# EAGLE design ig-normal-ver12 (EAGLE 9.6.2)
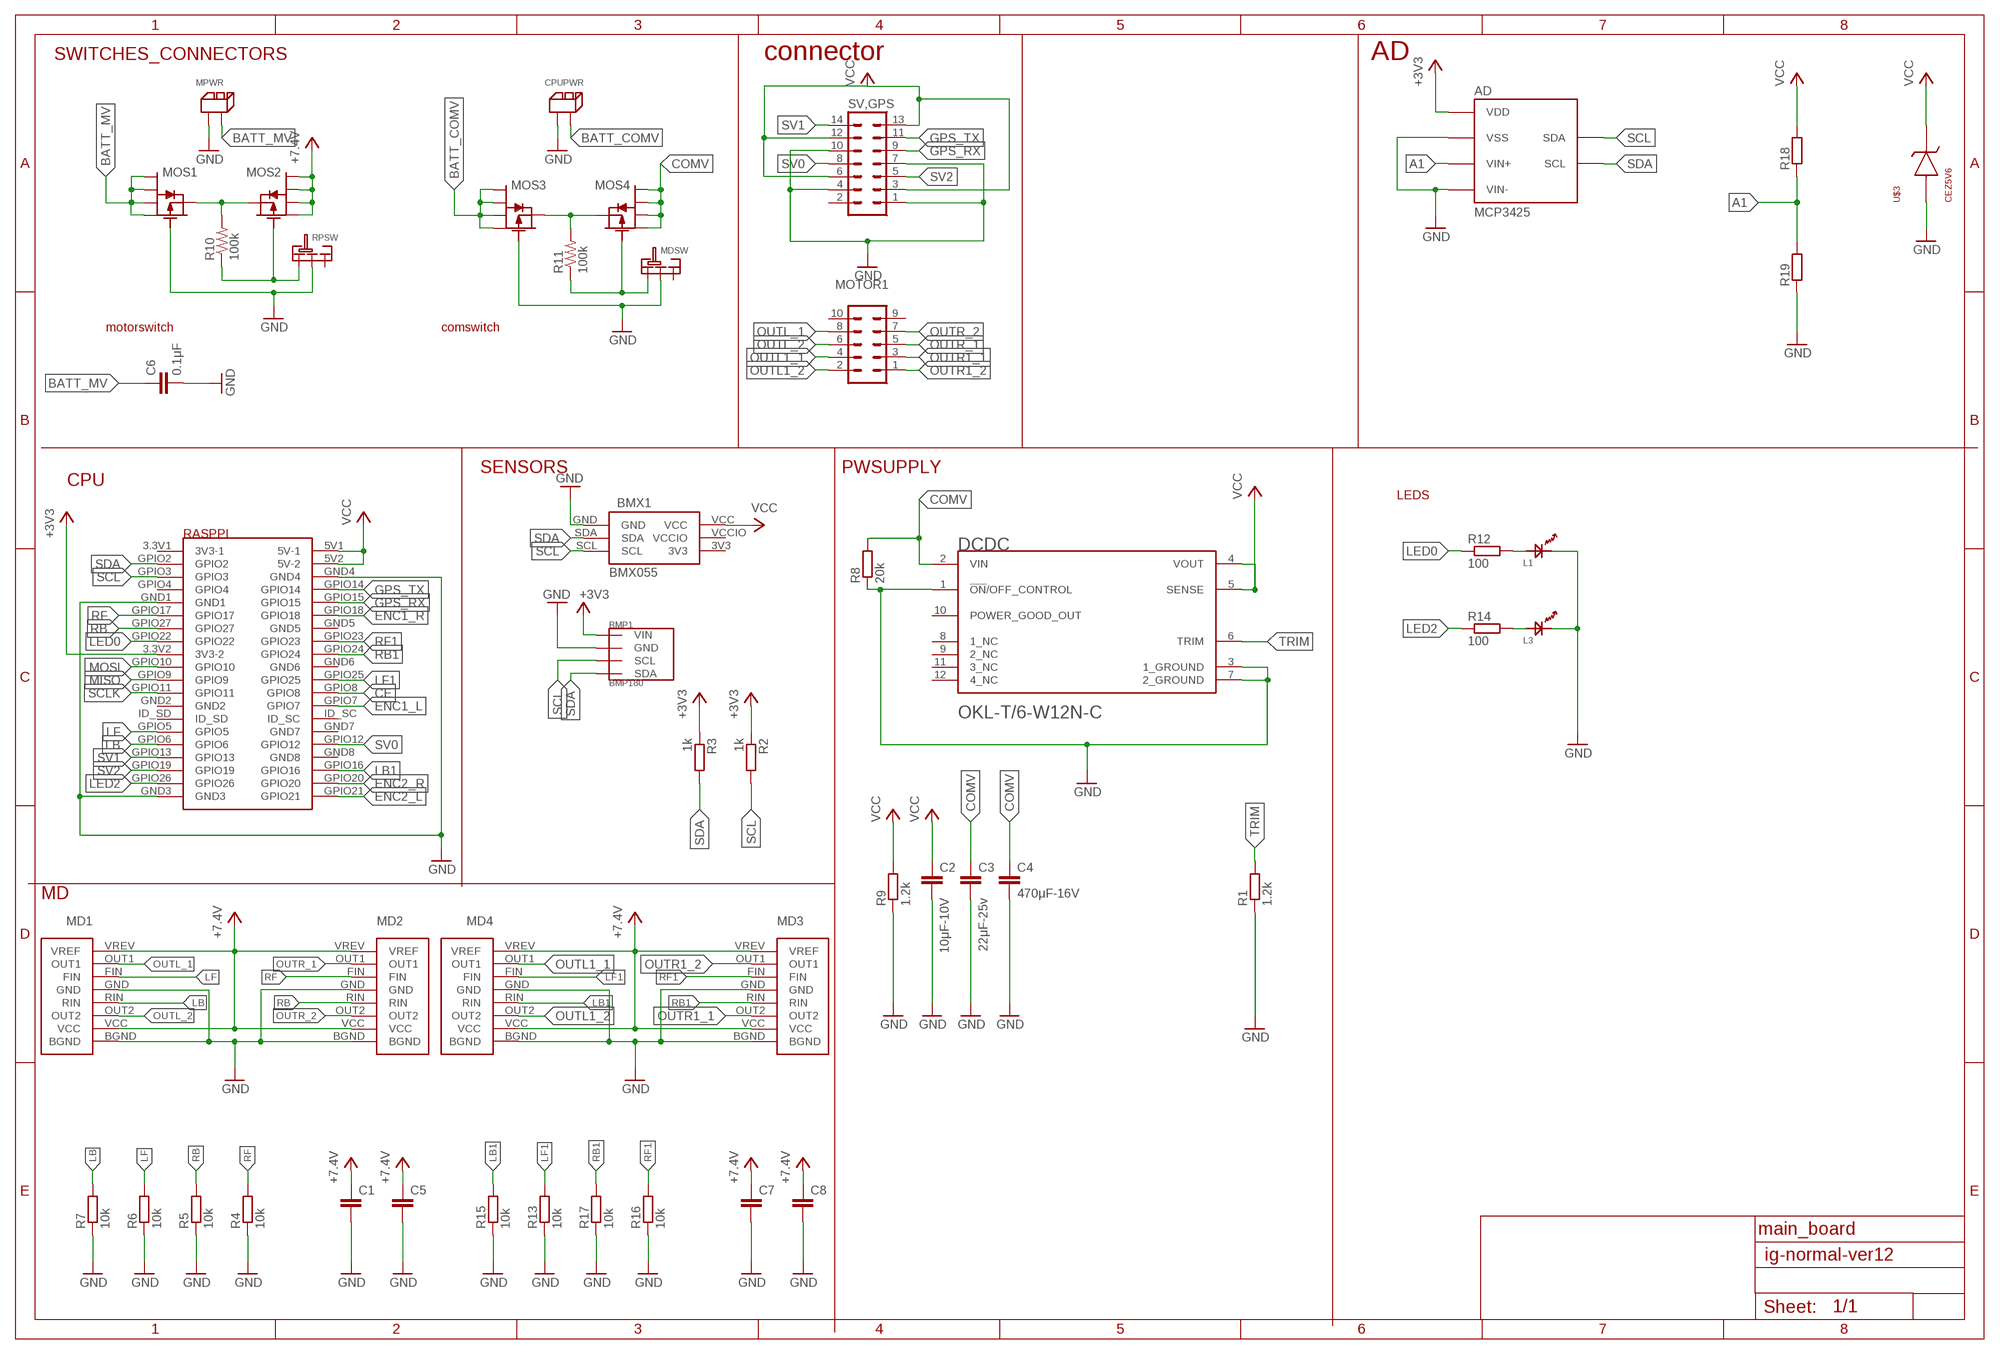
[diagram p0: schematic, sheet 1]

## Parts
AD  MCP3425  [SOT23-6]
BMP1  BMP180  [GY-68]
BMX1  BMX055  [BMX055]
C1  C-EUC0603  [C0603]
C2  10μF-10V  C-EUC0603  [C0603]
C3  22μF-25v  C-EUC0805  [C0805]
C4  470μF-16V  C-EUC0603  [C0603]
C5  C-EUC0603  [C0603]
C6  0.1μF  C-EUC0603  [C0603]
C7  C-EUC0603  [C0603]
C8  C-EUC0603  [C0603]
CPUPWR  2PIN  [2PIN]
DCDC  OKL-T/6-W12N-CMURATA_OKL-T-6-W12N-C_0_0  [MURATA_OKL-T-6-W12N-C_0]
L1  OSXX1608C1A  [OSXX1608C1A]
L3  OSXX1608C1A  [OSXX1608C1A]
MD1  BD6222HFP-TR  [BD6222HFP-TR]
MD2  BD6222HFP-TR  [BD6222HFP-TR]
MD3  BD6222HFP-TR  [BD6222HFP-TR]
MD4  BD6222HFP-TR  [BD6222HFP-TR]
MDSW  SRIDE_SWITCH  [SRIDE_SWITCH]
MOS1  PCH_SSM6J808R  [SSM6J808R]
MOS2  PCH_SSM6J808R  [SSM6J808R]
MOS3  PCH_SSM6J808R  [SSM6J808R]
MOS4  PCH_SSM6J808R  [SSM6J808R]
MOTOR1  ML10L  [ML10L]
MPWR  2PIN  [2PIN]
R1  1.2k  R-EU_R0805  [R0805]
R2  1k  R-EU_R0603  [R0603]
R3  1k  R-EU_R0603  [R0603]
R4  10k  R-EU_R0603  [R0603]
R5  10k  R-EU_R0603  [R0603]
R6  10k  R-EU_R0603  [R0603]
R7  10k  R-EU_R0603  [R0603]
R8  20k  R-EU_R0603  [R0603]
R9  1.2k  R-EU_R0805  [R0805]
R10  100k  R-US_R0603  [R0603]
R11  100k  R-US_R0603  [R0603]
R12  100  R-EU_R0603  [R0603]
R13  10k  R-EU_R0603  [R0603]
R14  100  R-EU_R0603  [R0603]
R15  10k  R-EU_R0603  [R0603]
R16  10k  R-EU_R0603  [R0603]
R17  10k  R-EU_R0603  [R0603]
R18  R-EU_R0603  [R0603]
R19  R-EU_R0603  [R0603]
RASPPI  RASPBERYPIZEROW  [RASPBERYPIZEROW]
RPSW  SRIDE_SWITCH  [SRIDE_SWITCH]
SV,GPS  ML14L  [ML14L]
U$3  CEZ5V6  [CEZ5V6]

## Nets
+3V3 [PWR]: AD.5(VDD) BMP1.P1(VIN) R2.1 R3.1 RASPPI.3.3V2(3V3-2)
+5V [PWR]: C1.1 C5.1 C7.1 C8.1 MD1.VCC MD1.VREV(VREF) MD2.VCC MD2.VREV(VREF) MD3.VCC MD3.VREV(VREF) MD4.VCC MD4.VREV(VREF) MOS2.1 MOS2.2 MOS2.5 MOS2.6 ; supply symbol labelled +7.4V
A1: AD.1(VIN+) R18.1 R19.2
BATT_COMV [PWR]: CPUPWR.P$2 MOS3.1 MOS3.2 MOS3.5 MOS3.6
BATT_MV [PWR]: C6.1 MOS1.1 MOS1.2 MOS1.5 MOS1.6 MPWR.P$2
CE: RASPPI.GPIO8
COMV [PWR]: C3.1 C4.1 DCDC.2(VIN) MOS4.1 MOS4.2 MOS4.5 MOS4.6 R8.2
ENC1_L: RASPPI.GPIO7
ENC1_R: RASPPI.GPIO18
ENC2_L: RASPPI.GPIO21
ENC2_R: RASPPI.GPIO20
GND [mospwr]: AD.2(VSS) AD.6(VIN-) BMP1.P2(GND) BMX1.GND C1.2 C2.2 C3.2 C4.2 C5.2 C6.2 C7.2 C8.2 CPUPWR.P$1 DCDC.1(!ON!/OFF_CONTROL) DCDC.3(1_GROUND) DCDC.7(2_GROUND) L1.CT L3.CT MD1.BGND MD1.GND MD2.BGND MD2.GND MD3.BGND MD3.GND MD4.BGND MD4.GND MDSW.LR MOS1.3 MOS3.3 MPWR.P$1 R1.1 R4.1 R5.1 R6.1 R7.1 R8.1 R9.1 R13.1 R15.1 R16.1 R17.1 R19.1 RASPPI.GND1 RASPPI.GND3 RASPPI.GND4 RPSW.LR SV,GPS.1 SV,GPS.4 SV,GPS.7 SV,GPS.10 U$3.P$1
GPS_RX: RASPPI.GPIO15 SV,GPS.9
GPS_TX: RASPPI.GPIO14 SV,GPS.11
LB: MD1.RIN R7.2 RASPPI.GPIO6
LB1: MD4.RIN R15.2 RASPPI.GPIO16
LED0: R12.1 RASPPI.GPIO22
LED2: R14.1 RASPPI.GPIO26
LF: MD1.FIN R6.2 RASPPI.GPIO5
LF1: MD4.FIN R13.2 RASPPI.GPIO25
MISO: RASPPI.GPIO9
MOSI: RASPPI.GPIO10
N$1 [mospwr]: MOS3.4 MOS4.4 R11.2
N$2 [mospwr]: MDSW.L MOS4.3 R11.1
N$3: L1.AN R12.2
N$5: L3.AN R14.2
N$6 [mospwr]: MOS1.4 MOS2.4 R10.2
N$7 [mospwr]: MOS2.3 R10.1 RPSW.L
OUTL1_1: MD4.OUT1 MOTOR1.4
OUTL1_2: MD4.OUT2 MOTOR1.2
OUTL_1: MD1.OUT1 MOTOR1.8
OUTL_2: MD1.OUT2 MOTOR1.6
OUTR1_1: MD3.OUT2 MOTOR1.3
OUTR1_2: MD3.OUT1 MOTOR1.1
OUTR_1: MD2.OUT1 MOTOR1.5
OUTR_2: MD2.OUT2 MOTOR1.7
RB: MD2.RIN R5.2 RASPPI.GPIO27
RB1: MD3.RIN R17.2 RASPPI.GPIO24
RF: MD2.FIN R4.2 RASPPI.GPIO17
RF1: MD3.FIN R16.2 RASPPI.GPIO23
SCL: AD.4(SDA) BMP1.P3(SCL) BMX1.SCL R2.2 RASPPI.GPIO3
SCLK: RASPPI.GPIO11
SDA: AD.3(SCL) BMP1.P4(SDA) BMX1.SDA R3.2 RASPPI.GPIO2
SV0: RASPPI.GPIO12 SV,GPS.8
SV1: RASPPI.GPIO13 SV,GPS.14
SV2: RASPPI.GPIO19 SV,GPS.5
TRIM: DCDC.6(TRIM) R1.2
VCC [PWR]: BMX1.VCC C2.1 DCDC.4(VOUT) DCDC.5(SENSE) R9.2 R18.2 RASPPI.5V1(5V-1) RASPPI.5V2(5V-2) SV,GPS.3 SV,GPS.6 SV,GPS.12 SV,GPS.13 U$3.P$2
Unconnected: DCDC.8(1_NC) DCDC.9(2_NC) DCDC.10(POWER_GOOD_OUT) DCDC.11(3_NC) DCDC.12(4_NC) MDSW.R MOTOR1.9 MOTOR1.10 RASPPI.3.3V1(3V3-1) RASPPI.GND2 RASPPI.GND5 RASPPI.GND6 RASPPI.GND7 RASPPI.GND8 RASPPI.GPIO4 RASPPI.ID_SC RASPPI.ID_SD RPSW.R SV,GPS.2

## Notes on the sheet
- SWITCHES_CONNECTORS | connector | AD
- motorswitch | comswitch
- SENSORS | PWSUPPLY
- CPU
- LEDS
- MD
- main_board

## Power pins joined to a net without a drawn wire
3V3: BMX1.3V3
VCCIO: BMX1.VCCIO

## Library data of the parts
AD = bt:MCP3425: Microchip MCP3425 ADC The MCP3425 is a single channel low-noise, high accuracy ?? A/D converter with differential inputs and up to 16 bits of resolution in a small SOT-23-6 package. The on-board precision 2.048V reference voltage enables an input range of ±2.048V differentially (? voltage = 4.096V). The device uses a two-wire I2C compatible serial interface and operates from a single 2.7V to 5.5V power supply. The MCP3425 device performs conversion at rates of 15, 60, or 240 samples per second (SPS) depending on the user controllable configuration bit settings using the two-wire I2C serial interface Reference: http://ww1.microchip.com/downloads/en/DeviceDoc/22072a.pdf
BMP1 = BMP180:BMP180
BMX1 = BMX055:BMX055
C1-C8 = rcl:C-EU: CAPACITOR, European symbol; SPICEPREFIX: C
CPUPWR MPWR = XR Connector:2PIN
DCDC = OKL-T_6-W12N-C:OKL-T/6-W12N-C: Non-Isolated PoL Module DC DC Converter 1 Output 0.591 ~ 5.5V - - 6A 4.5V - 14V Input; AUTOMOTIVE: No; CENTROID_NOT_SPECIFIED: No; DATASHEET: https://www.murata.com/en-us/products/productdetail.aspx?partno=OKL-T/6-W12N-C; DEVICE_CLASS_L1: Integrated Circuits (ICs); DEVICE_CLASS_L2: Power Management ICs; DEVICE_CLASS_L3: Voltage Regulators - Switching; DIGIKEY_DESCRIPTION: DC DC CONVERTER 0.591-5.5V 30W; DIGIKEY_PART_NUMBER: 811-2214-1-ND; FOOTPRINT_VARIANT_NAME_0: Recommended_Land_Pattern; HEIGHT: 7.2mm; LEAD_FREE: Yes; MAX_SUPPLY_VOLTAGE: 14V; MF: Murata; MFG_PACKAGE_IDENT: OKL-T/6-W12; MFG_PACKAGE_IDENT_COMPONENT_ID: 4873da16363307f0; MFG_PACKAGE_IDENT_DATE: 0; MFG_PACKAGE_IDENT_REV: 0; MIN_SUPPLY_VOLTAGE: 4.5V; MOUSER_DESCRIPTION: Non-Isolated DC/DC Converters 12Vin .59-5.5Vout 6A 30W Neg Polarity; MOUSER_PART_NUMBER: 580-OKL-T/6-W12N-C; MPN: OKL-T/6-W12N-C; NOMINAL_SUPPLY_CURRENT: 20mA; NUMBER_OF_OUTPUTS: 1; OUTPUT_CURRENT: 6A; OUTPUT_TYPE: AdjustableProgrammable; OUTPUT_VOLTAGE: 0.591-5.5V; PACKAGE: iLGA12; PREFIX: MD; ROHS: Yes; SWITCHING_FREQUENCY: 600kHz; SWITCHING_TOPOLOGY: Buck; TEMPERATURE_RANGE_HIGH: +85°C; TEMPERATURE_RANGE_LOW: -40°C; VERIFICATION_VERSION: 0.0.0.3
L1 L3 = Chip LED:OSXX1608C1A
MD1-MD4 = BD6222HFP-TR:BD6222HFP-TR
MDSW RPSW = Sride Switch:SRIDE_SWITCH
MOS1-MOS4 = Chip MOSFET:PCH_SSM6J808R
MOTOR1 = con-ml:ML10L: HARTING; OC_FARNELL: unknown; OC_NEWARK: unknown
R1-R9 R12-R19 = rcl:R-EU_: RESISTOR, European symbol; SPICEPREFIX: R
R10 R11 = rcl:R-US_: RESISTOR, American symbol; SPICEPREFIX: R
RASPPI = RaspberyPiZeroW:RASPBERYPIZEROW
SV,GPS = con-ml:ML14L: HARTING; OC_FARNELL: unknown; OC_NEWARK: unknown
U$3 = CEZXVX:CEZ5V6

## Net classes
1 PWR: width 0.8 mm, clearance 0.1 mm
2 mospwr: width 0.45 mm

## Board
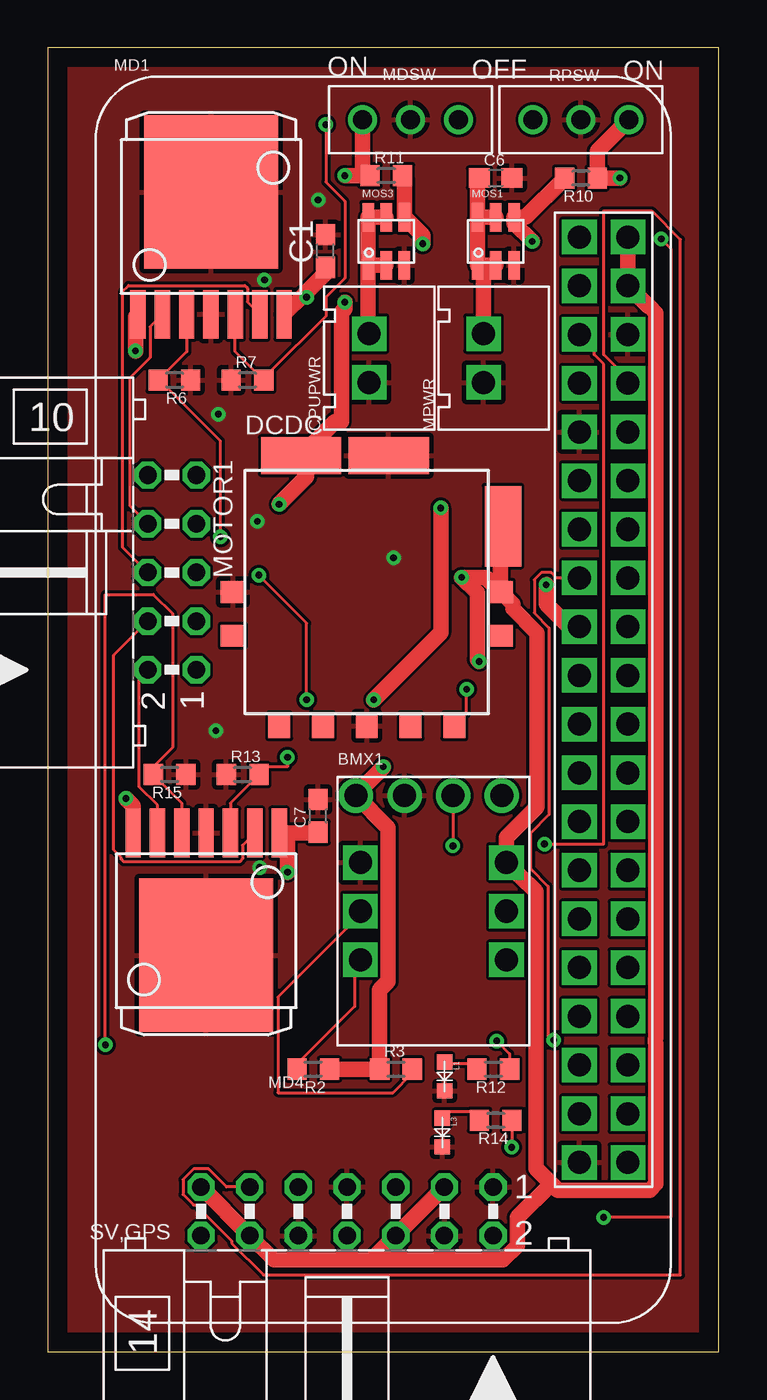
[diagram p1: board, top side]
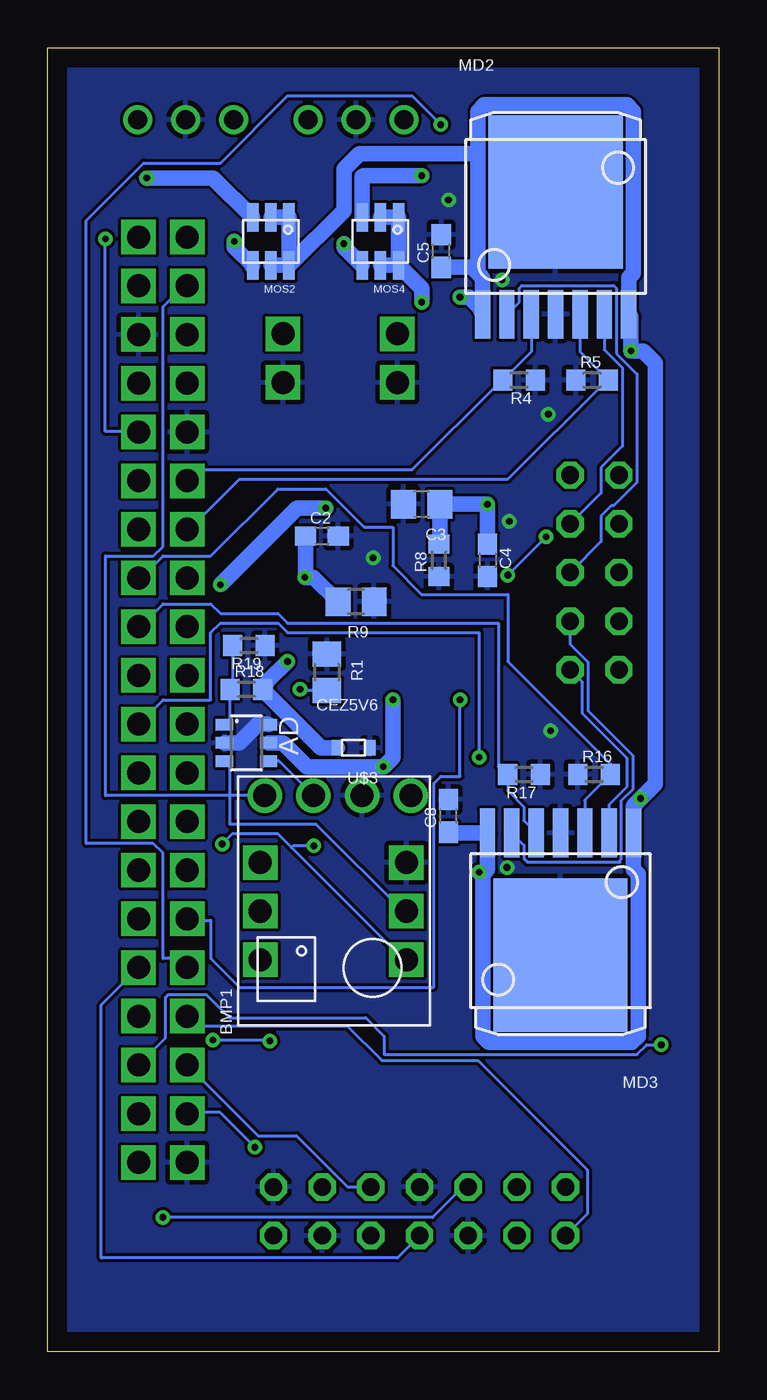
[diagram p2: board, bottom side, seen from below]

Size 35 x 68 mm. Coordinates in mm from the lower left corner, seen from the top.
Outline: 0,0 35,0 35,68 0,68 0,0
Copper layers (1*16): Top 0.035mm / dielectric 1.5mm / Bottom 0.035mm
Design rules "default": minimum track width 6mil, minimum drill 0.35mm, track to track 6mil, track to pad 6mil, pad to pad 6mil, via to via 6mil, smd to smd 6mil, copper to edge 40mil, drill to drill 6mil, minimum pad ring 10mil, minimum via ring 8mil, stop-mask expansion 4mil, vias tented up to drill 0mil, thermal gap 10mil

### Footprints (pad centres in the part's own frame; a part is rotated, then mirrored left to right if it is on the bottom)
SOT23-6 = smd 0.6 x 0.9: 1 -0.95,-1.15; 2 0,-1.15; 3 0.95,-1.15; 4 0.95,1.15; 5 0,1.15; 6 -0.95,1.15
GY-68 = drill 1.2: P1 -5,4; P2 -5,1.46; P3 -5,-1.08; P4 -5,-3.62
BMX055 = drill 1.2 pad 1.5 square: 3V3 8.81,-9.53; GND 1.19,-4.46; SCL 1.19,-9.53; SDA 1.19,-7; VCC 8.81,-4.46; VCCIO 8.81,-7
C0603 = smd 1.1 x 1: 1 -0.85,0; 2 0.85,0
C0805 = smd 1.3 x 1.5: 1 -0.95,0; 2 0.95,0
2PIN = drill 1.2 square: P$1 -1.27,0; P$2 1.27,0
MURATA_OKL-T-6-W12N-C_0 = smd 1.27 x 1.143: 1 -6.985,0; 5 6.985,0; 10 -6.985,-2.286; 11 6.985,-2.286 | smd 4.191 x 1.905: 2 -3.429,7.112; 3 1.143,7.112 | smd 1.905 x 4.191: 4 7.112,3.429 | smd 1.143 x 1.27: 6 4.572,-6.985; 7 0,-6.985; 8 -2.286,-6.985; 9 -4.572,-6.985; 12 2.286,-6.985
OSXX1608C1A = smd 0.8 x 0.8: AN -0.75,0; CT 0.75,0
BD6222HFP-TR = smd 7 x 8: BGND 0,6.378 | smd 0.8 x 2.54: FIN -1.27,0; GND 0,0; OUT1 -2.54,0; OUT2 2.54,0; RIN 1.27,0; VCC 3.81,0; VREV -3.81,0
SRIDE_SWITCH = drill 1: L -2.5,0; LR 0,0; R 2.5,0
SSM6J808R = smd 0.6 x 1.5: 1 -0.95,-1.25; 2 0,-1.25; 3 0.95,-1.25; 4 0.95,1.25; 5 0,1.25; 6 -0.95,1.25
ML10L = drill 0.914 octagon: 1 -5.08,-1.27; 2 -5.08,1.27; 3 -2.54,-1.27; 4 -2.54,1.27; 5 0,-1.27; 6 0,1.27; 7 2.54,-1.27; 8 2.54,1.27; 9 5.08,-1.27; 10 5.08,1.27
R0805 = smd 1.3 x 1.5: 1 -0.95,0; 2 0.95,0
R0603 = smd 1 x 1.1: 1 -0.85,0; 2 0.85,0
RASPBERYPIZEROW = drill 1.2 pad 1.676 square: 3.3V1 -1.27,24.13; 3.3V2 -1.27,3.81; 5V1 1.27,24.13; 5V2 1.27,21.59; GND1 -1.27,13.97; GND2 -1.27,-6.35; GND3 -1.27,-24.13; GND4 1.27,19.05; GND5 1.27,8.89; GND6 1.27,1.27; GND7 1.27,-11.43; GND8 1.27,-16.51; GPIO2 -1.27,21.59; GPIO3 -1.27,19.05; GPIO4 -1.27,16.51; GPIO5 -1.27,-11.43; GPIO6 -1.27,-13.97; GPIO7 1.27,-6.35; GPIO8 1.27,-3.81; GPIO9 -1.27,-1.27; GPIO10 -1.27,1.27; GPIO11 -1.27,-3.81; GPIO12 1.27,-13.97; GPIO13 -1.27,-16.51; GPIO14 1.27,16.51; GPIO15 1.27,13.97; GPIO16 1.27,-19.05; GPIO17 -1.27,11.43; GPIO18 1.27,11.43; GPIO19 -1.27,-19.05; GPIO20 1.27,-21.59; GPIO21 1.27,-24.13; GPIO22 -1.27,6.35; GPIO23 1.27,6.35; GPIO24 1.27,3.81; GPIO25 1.27,-1.27; GPIO26 -1.27,-21.59; GPIO27 -1.27,8.89; ID_SC 1.27,-8.89; ID_SD -1.27,-8.89
ML14L = drill 0.914 octagon: 1 -7.62,-1.27; 2 -7.62,1.27; 3 -5.08,-1.27; 4 -5.08,1.27; 5 -2.54,-1.27; 6 -2.54,1.27; 7 0,-1.27; 8 0,1.27; 9 2.54,-1.27; 10 2.54,1.27; 11 5.08,-1.27; 12 5.08,1.27; 13 7.62,-1.27; 14 7.62,1.27
CEZ5V6 = smd 0.6 x 0.8: P$1 -0.85,0; P$2 0.85,0

### Placement (x,y rotation side)
AD  24.64,31.75 270 bottom
BMP1  20.07,24 270 bottom
BMX1  15.11,29.97 0 top
C1  14.48,57.4 90 top
C2  20.7,42.55 0 bottom
C3  15.49,44.2 180 bottom
C4  12.06,41.27 270 bottom
C5  14.48,57.4 90 bottom
C6  23.37,61.21 0 top
C7  14.1,27.94 90 top
C8  14.1,27.94 90 bottom
CPUPWR  16.76,51.82 90 top
DCDC  16.64,39.62 0 top
L1  20.7,14.35 270 top
L3  20.57,11.43 270 top
MD1  8.51,54.1 0 top
MD2  8.51,54.1 0 bottom
MD3  8.26,27.05 180 bottom
MD4  8.26,27.05 180 top
MDSW  18.92,64.26 0 top
MOS1  23.37,57.91 0 top
MOS2  23.37,57.91 180 bottom
MOS3  17.65,57.91 0 top
MOS4  17.65,57.91 180 bottom
MOTOR1  6.48,40.64 90 top
MPWR  22.73,51.82 90 top
R1  20.45,35.43 270 bottom
R2  13.84,14.73 180 top
R3  18.16,14.73 0 top
R4  10.41,50.67 180 bottom
R5  6.6,50.67 0 bottom
R6  6.6,50.67 180 top
R7  10.41,50.67 0 top
R8  14.61,41.27 90 bottom
R9  18.92,39.12 180 bottom
R10  27.81,61.21 180 top
R11  17.65,61.34 0 top
R12  23.24,14.73 180 top
R13  10.16,30.1 0 top
R14  23.37,12.06 180 top
R15  6.35,30.1 180 top
R16  6.5,30.1 0 bottom
R17  10.16,30.1 180 bottom
R18  24.64,34.54 0 bottom
R19  24.51,36.83 180 bottom
RASPPI  29,34 0 top
RPSW  27.81,64.26 180 top
SV,GPS  15.61,7.32 180 top
U$3  19.05,31.5 180 bottom

### Tracks (layer width: path | path; a pad name or v marks a point on that pad's centre or on a via)
+3V3  (via drill 0.35)
  Top 0.8: v17,34 20.5,37.5 v20.5,44 | v26,40 26,39 27.5,37.5 RASPPI.3.3V2 | v17.5,30.5 16.07,29.07 BMP1.P1 17.75,27.31 17.75,19.31 17.31,18.87 R3.1 R2.1
  Bottom 0.8: v17,34 17,31 v17.5,30.5 21.49,30.5 22.74,31.75 AD.5 | v20.5,44 22,44 v26,40
+5V  (via drill 0.35)
  Top 0.8: MD2.VCC 4.57,53.98 v4.57,52.2 | C8.1 14.06,27.05 12.5,27.05 | 12.5,27.05 MD3.VCC | C5.1 14.48,56.26 13.36,55.14 | 13.36,55.14 MD1.VCC | v4.08,28.85 4.08,28.82 4.45,28.45 MD4.VCC | v12.5,25 12.5,27.05 | v13.5,55 13.36,55.14
  Bottom 0.8: MOS2.2 MOS2.1 MOS2.6 | MOS2.6 MOS2.5 | 12.31,24.9 12.31,16.45 11.98,16.12 4.53,16.12 4.2,16.45 4.2,24.9 4.45,25.14 MD4.VCC 4.45,28.46 4.06,28.84 v4.08,28.85 4.05,28.85 3.31,29.6 3.31,51.56 3.94,52.2 v4.57,52.2 4.57,53.98 MD2.VCC 4.7,56.01 4.46,56.25 4.46,64.71 4.78,65.03 12.24,65.03 12.56,64.71 12.56,62.48 | 12.31,24.9 12.06,25.14 MD3.VCC 14.06,27.05 C8.1 | 12.56,62.48 12.56,56.25 | 12.56,56.25 12.32,56.01 MD1.VCC 12.5,54.5 13,55 v13.5,55 | MOS2.6 19.56,59.52 19.56,61.67 18.75,62.48 12.56,62.48 | C5.1 12.87,56.55 12.56,56.25 | v12.5,25 12.31,24.9
A1
  Bottom 0.152: R19.2 25.36,34.67 R18.1 25.49,33 AD.1
BATT_COMV
  Top 0.8: MOS3.5 MOS3.6 MOS3.1 | MOS3.1 MOS3.2 | MOS3.1 16.7,53.15 CPUPWR.P$2
BATT_MV
  Top 0.8: C6.1 22.42,61.11 MOS1.6 | MOS1.5 MOS1.6 | MOS1.2 MOS1.1 | MOS1.1 MOS1.6 | MOS1.1 22.73,56.35 MPWR.P$2
COMV  (via drill 0.35)
  Top 0.8: v15.49,54.74 15.49,54.4 15.31,54.22 15.31,48.52 14.99,48.52 DCDC.2 13.5,46.44 13.5,45.63 v12.06,44.2
  Bottom 0.8: MOS4.2 MOS4.1 MOS4.6 | MOS4.6 MOS4.5 | MOS4.6 15.49,55.45 v15.49,54.74 | C4.1 v12.06,44.2 C3.1 14.54,42.19 R8.2
GND  (via drill 0.35)
  Bottom 0.8: AD.6 23.53,32.74 24.03,32.74 25.02,31.75 AD.2
  other vias: 18.03,41.4 11.3,55.91 11.05,25.25 10.92,43.31 14.1,60.07 8.89,48.9 8.76,32.38
  pour Top: 0.13,68.83 36.32,68.83 36.32,-1.65 -1.14,-1.65 -1.14,68.83
  pour Bottom: -1.02,68.83 36.32,68.83 36.32,-1.65 -1.14,-1.65 -1.14,68.83
GPS_RX  (via drill 0.35)
  Top 0.152: v29,7 32.5,7 32.5,57.54 v32,58.04
  Bottom 0.152: v32,58.04 32,48 30.5,48 RASPPI.GPIO15 | SV,GPS.9 13.35,8.59 14.93,7 v29,7
GPS_TX
  Top 0.152: RASPPI.GPIO14 30,51 29,52 29,59.5 31.5,59.5 33,58 33,4 11.24,4 9.59,5.66 9.59,5.77 7.72,7.64 7.6,7.64 7.05,8.2 7.05,8.97 7.6,9.53 8.38,9.53 9.32,8.59 SV,GPS.11
LB  (via drill 0.35)
  Top 0.152: MD1.RIN 9.78,52.16 R7.2 11.5,51 14.5,54 14.5,55 15.5,56 15.5,60 14.5,61 v14.5,64
  Bottom 0.152: v14.5,64 16,65.5 22.5,65.5 26,62 30,62 33,59 33,26.5 29.5,26.5 29,26 29,20.5 28,20.5 RASPPI.GPIO6
LB1  (via drill 0.35)
  Top 0.152: MD4.RIN 6.99,28.61 R15.2 5.5,30.5 6.5,31.5 6.5,38.5 5.5,39.5 3,39.5 v3,16
  Bottom 0.152: v3,16 3.76,16 4.27,15.49 17.45,15.49 17.45,16.45 18.41,17.41 25.53,17.41 26.73,18.62 28.73,18.62 28.86,18.48 28.86,16.36 RASPPI.GPIO16
LED0  (via drill 0.35)
  Top 0.152: RASPPI.GPIO22 26.54,40.35 26.26,40.63 25.74,40.63 25.37,40.26 25.37,38.53 26.15,37.75 26.15,28 25.16,27.02 25.16,25.2 26.09,24.27 26.09,16.24 v26.39,16.24 | v23.42,16.2 24.09,15.53 R12.1
  Bottom 0.152: v26.39,16.24 26.37,16.27 23.48,16.27 v23.42,16.2
LED2  (via drill 0.35)
  Top 0.152: R14.1 24.2,12.05 v24.2,10.65
  Bottom 0.152: v24.2,10.65 26.05,12.5 27.5,12.5 RASPPI.GPIO26
LF  (via drill 0.35)
  Top 0.152: MD1.FIN 7.24,52.16 R6.2 6,50.5 9,47.5 v9,42.5 | v11,40.5 13.5,38 v13.5,34
  Bottom 0.152: v11,40.5 v9,42.5 | v13.5,34 13.5,30 14.5,30 14.86,29.64 14.86,19 25,19 26.5,20.5 26.5,22.5 27.5,22.5 RASPPI.GPIO5
LF1  (via drill 0.35)
  Top 0.152: MD4.FIN 9.53,28.61 R13.2 11.5,30.5 12.5,30.5 v12.5,31
  Bottom 0.152: v12.5,31 12.5,37.5 22.5,37.5 23,38 26,38 26.5,37.5 26.5,34 29,34 RASPPI.GPIO25
N$1  (via drill 0.35)
  Top 0.8: R11.2 18.6,61.24 MOS3.4 19.56,58.21 v19.56,57.78
  Bottom 0.8: MOS4.4 19.56,57.62 v19.56,57.78
N$2  (via drill 0.35)
  Top 0.8: MDSW.L 16.42,61.72 R11.1 v15.49,61.34
  Bottom 0.8: MOS4.3 18.6,61.28 18.54,61.34 v15.49,61.34
N$3
  Top 0.152: L1.AN 21,15 22,15 R12.2
N$5
  Top 0.152: L3.AN 20.5,12.5 22.5,12.5 R14.2
N$6  (via drill 0.35)
  Top 0.8: R10.2 24.91,59.16 MOS1.4 24.32,58.87 v25.27,57.91
  Bottom 0.45: MOS2.4 24.5,56.5 MOS2.4
  Bottom 0.8: v25.27,57.91 25.27,57.62 MOS2.4
N$7  (via drill 0.35)
  Top 0.8: RPSW.L 28.66,62.61 R10.1 v29.84,61.21
  Bottom 0.8: MOS2.3 26.37,61.21 v29.84,61.21
OUTL1_1
  Top 0.152: MD4.OUT1 10.15,26.41 10.15,25.69 10.02,25.55 3.95,25.55 3.82,25.69 3.82,25.77 3.43,26.16 3.43,36.33 MOTOR1.4
OUTL1_2
  Top 0.152: MD4.OUT2 5.71,28.51 4.77,29.45 4.77,35.12 MOTOR1.2
OUTL_1
  Top 0.152: MD1.OUT1 5.33,53.46 5.33,51.85 4.27,50.79 4.27,44.12 MOTOR1.8
OUTL_2
  Top 0.152: MOTOR1.6 3.89,41.96 3.89,55.28 4.2,55.6 10.27,55.6 10.41,55.47 10.41,54.74 MD1.OUT2
OUTR1_1
  Bottom 0.152: MD3.OUT2 10.15,26.41 10.15,25.69 9.99,25.53 5.15,25.53 5.15,25.62 5.09,25.69 5.09,28.73 4.47,29.35 4.47,31.07 6.81,33.41 6.81,35.95 7.75,36.89 MOTOR1.3
OUTR1_2
  Bottom 0.152: MD3.OUT1 5.71,28.54 4.77,29.48 4.77,30.95 7.11,33.29 7.11,34.92 MOTOR1.1
OUTR_1
  Bottom 0.152: MD2.OUT1 10.41,54.74 10.41,55.47 10.27,55.6 5.47,55.6 5.34,55.47 5.34,52.71 5.33,52.7 5.33,52.06 4.27,50.99 4.27,45.33 5.48,44.12 5.6,44.12 6.15,43.57 6.15,42.24 MOTOR1.5
OUTR_2
  Bottom 0.152: MD2.OUT2 5.97,52.26 5.03,51.32 5.03,47.23 6.15,46.11 6.15,44.78 MOTOR1.7
RB
  Bottom 0.152: MD2.RIN 7.24,52.16 R5.2 6,50.5 11,45.5 25,45.5 27.5,43 RASPPI.GPIO27
RB1
  Bottom 0.152: MD3.RIN 10.17,27.69 10.17,28.42 11.01,29.26 R17.2 11.5,30.5 11.5,38 22.5,38 23,38.5 26,38.5 26.5,39 29,39 30,38 RASPPI.GPIO24
RF
  Bottom 0.152: MD2.FIN 9.78,52.16 R4.2 11.5,50.5 16,46 27,46 27.5,45.5 RASPPI.GPIO17
RF1
  Bottom 0.152: MD3.FIN 6.99,28.77 R16.2 5.65,30.65 11,36 11,39.5 15.5,39.5 17,41 17,43 18.5,43 20.5,45 23,45 26.5,41.5 29,41.5 30,40.5 RASPPI.GPIO23
SCL  (via drill 0.35)
  Top 0.152: R2.2 13,15 16,18 16,20 BMX1.SCL | v25.91,26.48 29,26.48 29,51.5 28.5,52 28.5,52.5 28,53 RASPPI.GPIO3 | BMP1.P3 21.15,26.39 v21.13,26.38
  Bottom 0.152: v25.91,26.48 25.38,27 23,27 22.29,26.29 | 22.29,26.29 16.5,20.5 BMX1.SCL | v21.13,26.38 22.2,26.38 22.29,26.29 | AD.4 22.94,30.8 BMP1.P3
SDA
  Top 0.152: R3.2 19,14.5 18,13.5 12,13.5 12,18.5 16,22.5 BMX1.SDA
  Bottom 0.152: 25.5,29 25.5,27.5 21,27.5 16.5,23 BMX1.SDA | 25.5,29 25.5,30.75 25.55,30.8 AD.3 | 25.5,29 32,29 32,41.5 29.5,41.5 29,42 29,54.5 28,55.5 RASPPI.GPIO2 | BMP1.P4 25.5,29
SV0
  Bottom 0.152: SV,GPS.8 16.76,4.89 32.22,4.89 32.22,18.08 RASPPI.GPIO12
SV1
  Bottom 0.152: RASPPI.GPIO13 27.5,17 19.39,17 17.58,15.19 12.57,15.19 6.86,9.47 6.86,7.18 SV,GPS.14
SV2
  Bottom 0.152: RASPPI.GPIO19 24.04,11.26 22.04,11.26 19.36,8.59 SV,GPS.5
TRIM  (via drill 0.35)
  Top 0.152: v21.84,34.54 21.84,33.27 DCDC.6
  Bottom 0.152: R1.2 21.78,34.48 v21.84,34.54
VCC  (via drill 0.35)
  Top 0.8: RASPPI.5V1 RASPPI.5V2 31.36,54.5 31.4,54.5 31.72,54.18 31.72,16.36 31.68,16.32 31.68,16.12 31.72,16.08 31.72,8.74 31.4,8.42 26.6,8.42 26.26,8.76 | 26.26,8.76 25.46,9.55 25.46,24.01 25.05,24.42 25.01,24.42 BMX1.VCC 23.92,26.81 25.52,28.4 25.52,37.49 24.26,38.76 24.26,38.99 DCDC.5 | v22.5,36 22.4,36.1 22.4,39.59 22.35,39.62 v21.59,40.39 22.86,40.39 DCDC.5 | DCDC.5 23.62,42.93 DCDC.4 | SV,GPS.13 SV,GPS.12 11.79,4.78 13.59,4.78 13.6,4.79 15.08,4.79 15.09,4.78 16.89,4.78 | 16.89,4.78 SV,GPS.6 SV,GPS.3 | 26.26,8.76 24.49,6.99 24.49,5.52 23.75,4.78 16.89,4.78
  Bottom 0.8: C2.1 21.55,40.42 v21.59,40.39 21.14,40.39 R9.2 | v22.5,36 23.5,35 R18.2 20.74,31.5 U$3.P$2

### Text on the board
tPlace: ON | OFF | ON